# EAGLE board LSPSM (EAGLE 6.5.0)
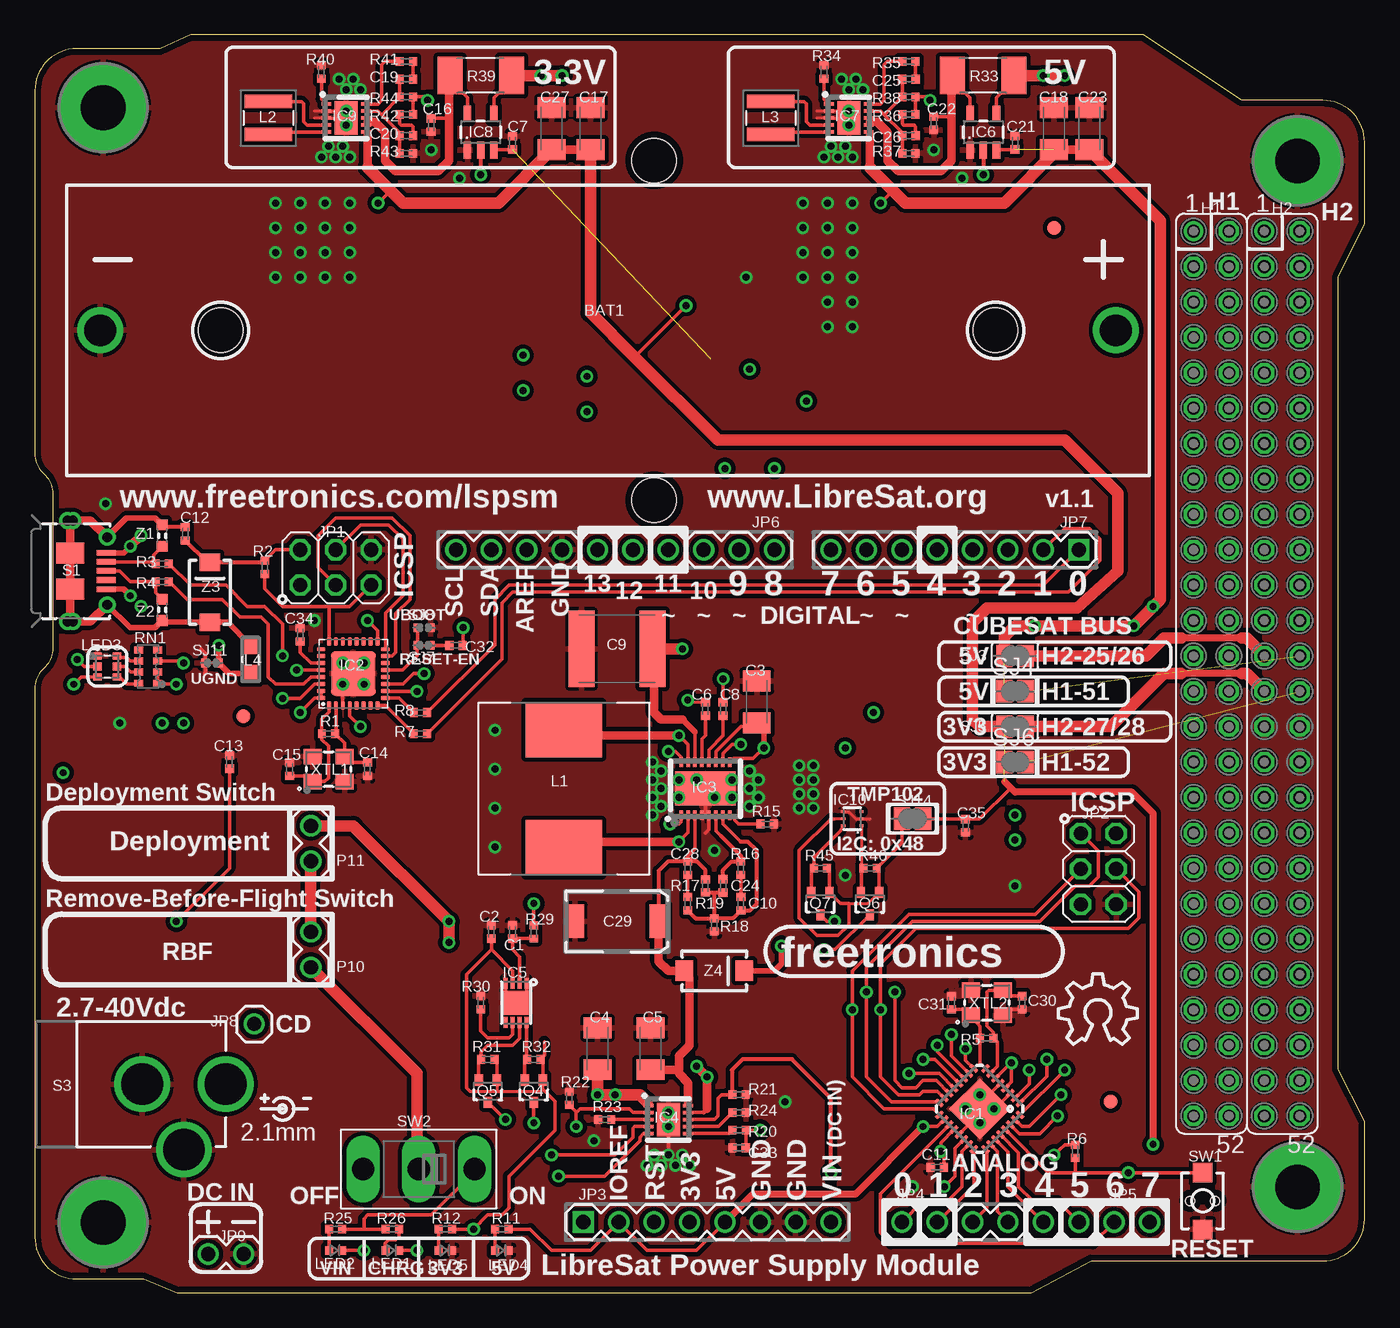
[diagram p4: board, top side]
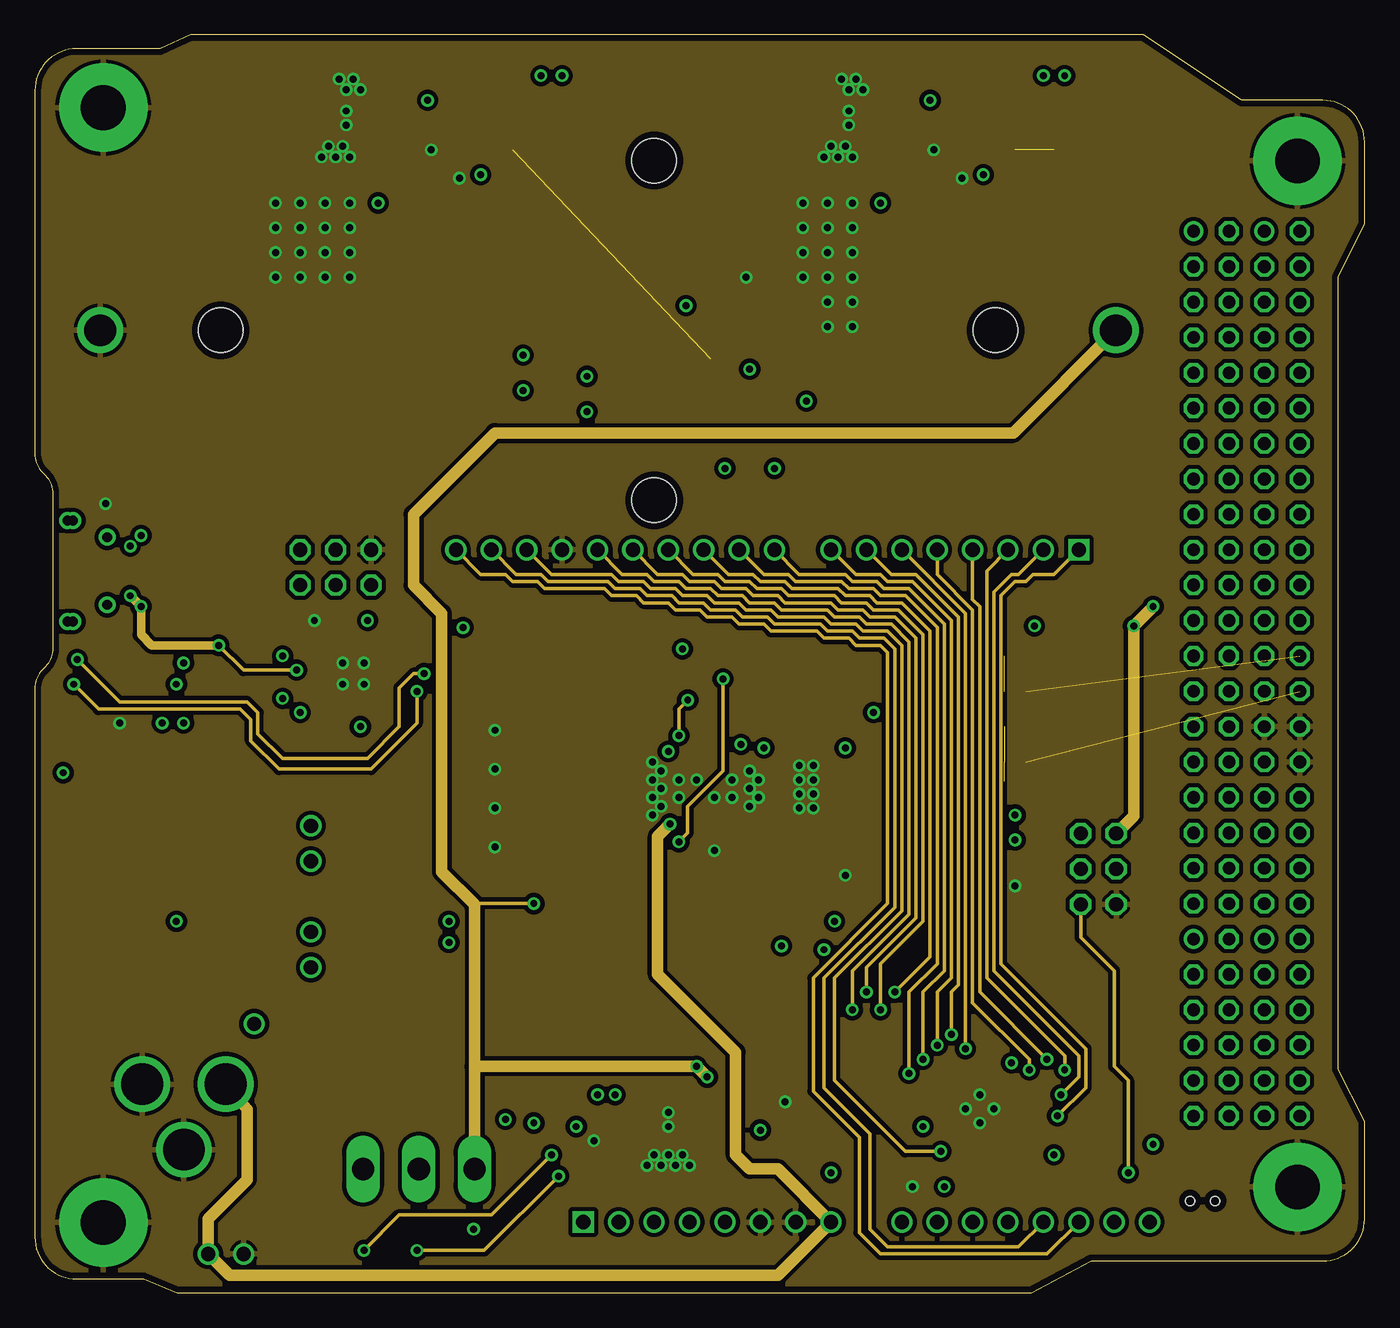
[diagram p5: board, inner layer Route2]
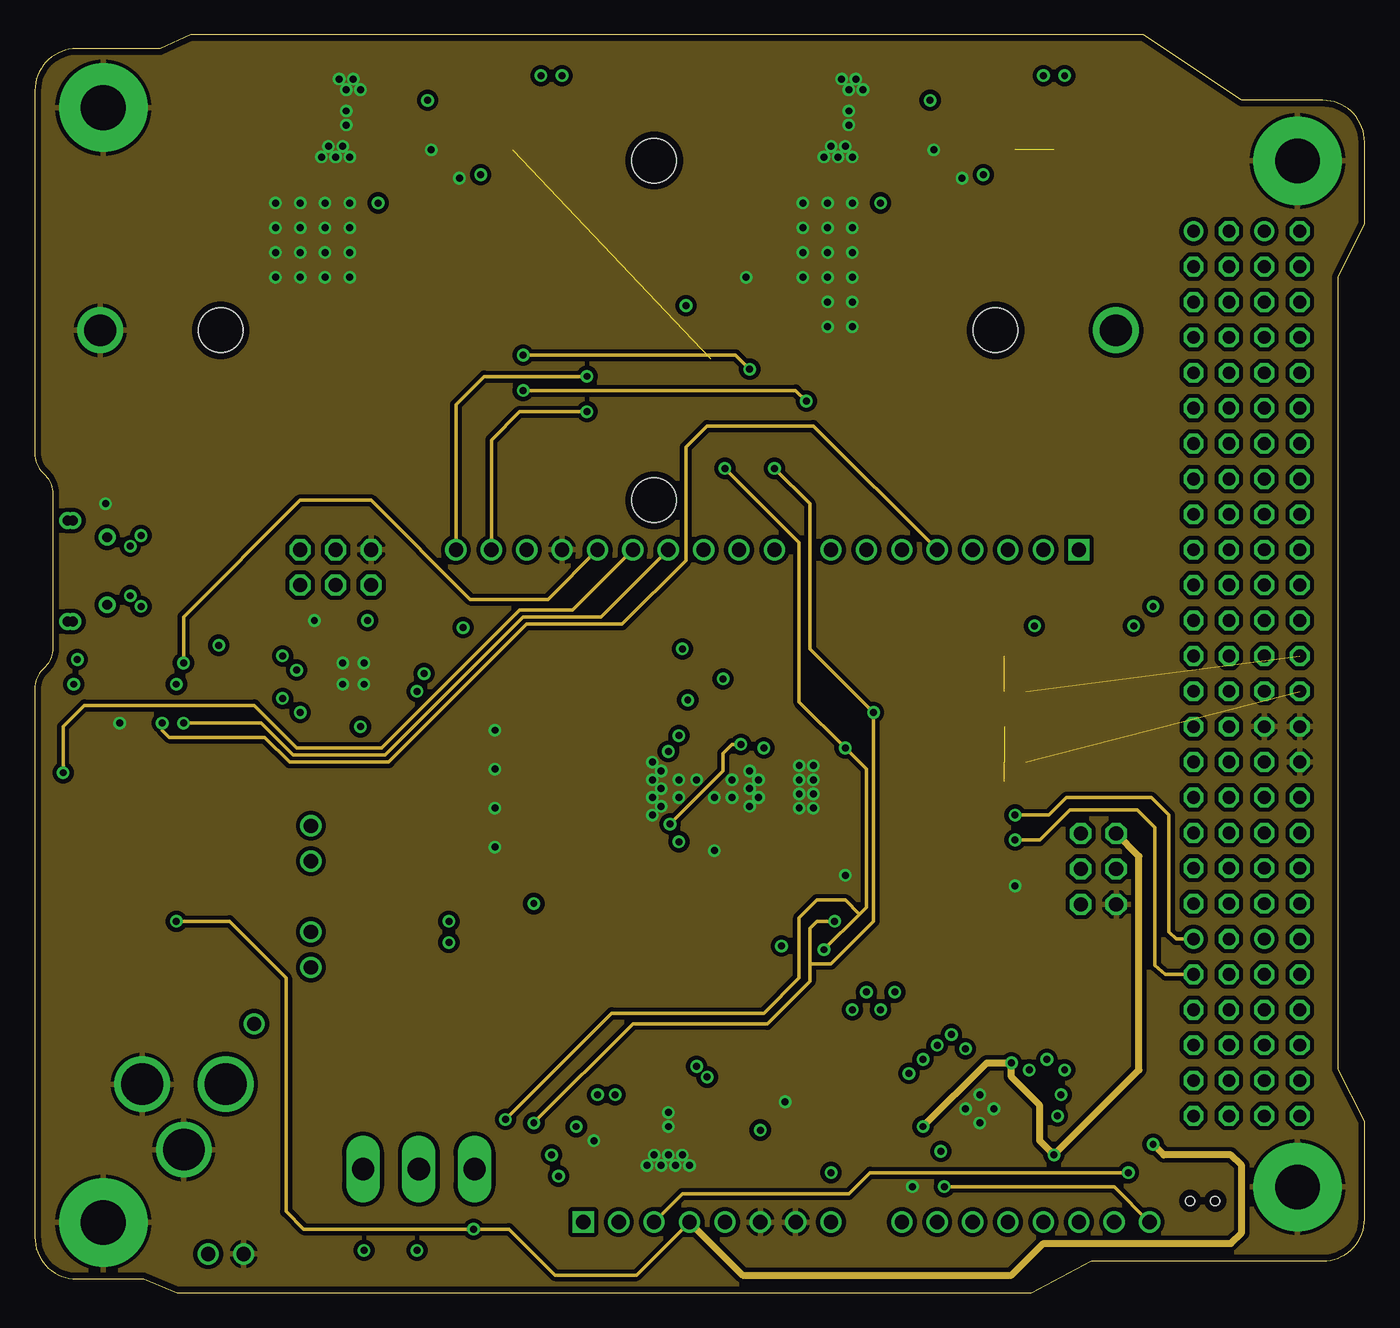
[diagram p6: board, inner layer Route15]
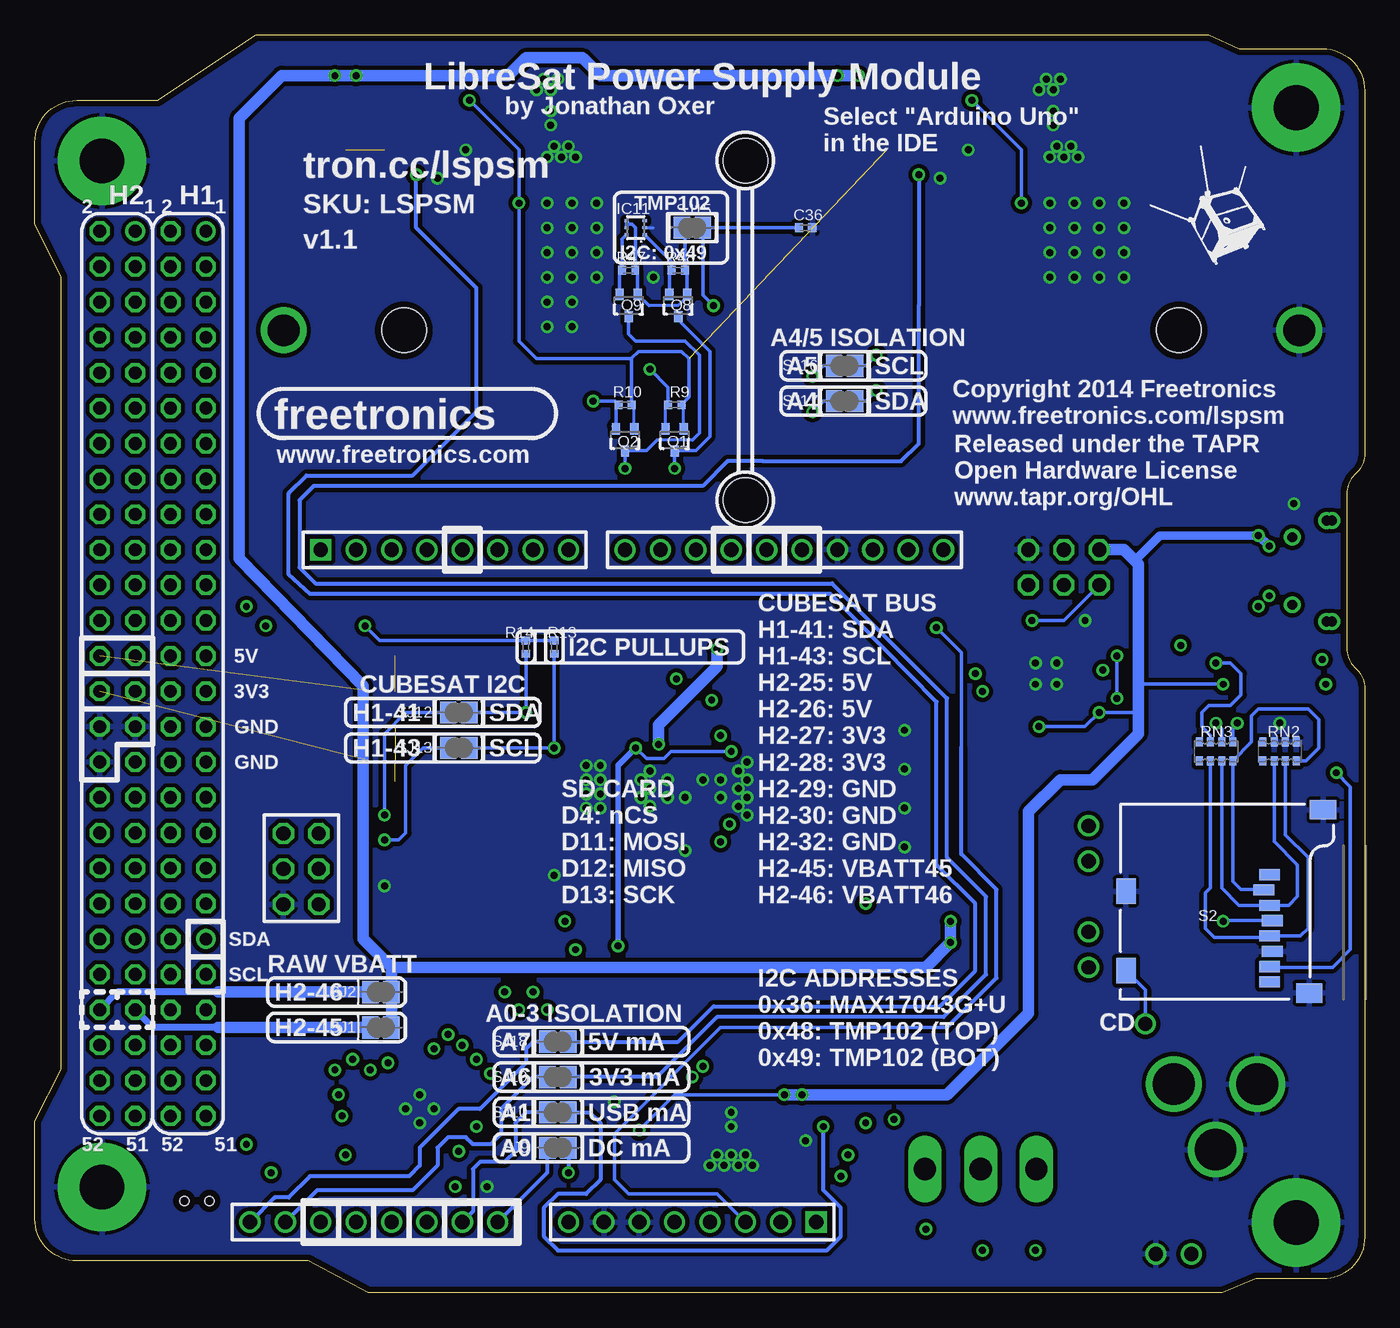
[diagram p7: board, bottom side, seen from below]

Size 95.45 x 90.3 mm. Coordinates in mm from the lower left corner, seen from the top.
Outline: 0,4 arc90 3,1 7.81,1 10.23,0 71.54,0 75.83,2.3 92.45,2.3 arc90 95.45,5.3 95.45,12.31 93.55,16.05 93.55,72.91 95.45,76.74 95.45,82.6 arc90 92.45,85.6 86.64,85.6 79.56,90.3 11.2,90.3 9,89.3 3,89.3 arc90 0,86.3 0,60.07 arc45 0.64,58.8 arc-45 1.27,57.53 1.27,46.1 arc-45 0.64,44.83 arc45 0,43.56 0,4
Copper layers (1+2*15+16): Top 0.035mm / dielectric 1.5mm / Route2 0.035mm / dielectric 0.15mm / Route15 0.035mm / dielectric 0.2mm / Bottom 0.035mm
Design rules "default *": minimum track width 6mil, minimum drill 19mil, track to track 6mil, track to pad 12mil, pad to pad 12mil, via to via 12mil, smd to smd 8mil, copper to edge 18mil, drill to drill 8mil, minimum pad ring 10mil, minimum via ring 8mil, stop-mask expansion 4mil, vias tented up to drill 20mil, thermal gap 10mil
Net classes: 0 default: width 0.152 mm, drill 0.241 mm, clearance 0.152 mm
Holes 3.2 mm at 44.45,81.28 44.45,56.9

## Footprints (pad centres in the part's own frame; a part is rotated, then mirrored left to right if it is on the bottom)
BH-18650-PC = drill 2.286: + 36.449,0; - -36.449,0 | hole 3.2: -27.813,0; 27.813,0
0402C = smd 0.59 x 0.64: 1 -0.48,0; 2 0.48,0
C1206K = smd 1.5 x 2: 1 -1.5,0; 2 1.5,0
C2220K = smd 1.85 x 5.5: 1 -2.55,0; 2 2.55,0
D3L = smd 1.3 x 2.4: NEG -3,0; POS 3,0
FIDUCIAL-1X2.5 = smd 1 x 1: 1 0,0
CUBESATBUS = drill 0.914: 1 -31.75,-1.27; 41 19.05,-1.27 | drill 0.914 octagon: 2 -31.75,1.27; 3 -29.21,-1.27; 4 -29.21,1.27; 5 -26.67,-1.27; 6 -26.67,1.27; 7 -24.13,-1.27; 8 -24.13,1.27; 9 -21.59,-1.27; 10 -21.59,1.27; 11 -19.05,-1.27; 12 -19.05,1.27; 13 -16.51,-1.27; 14 -16.51,1.27; 15 -13.97,-1.27; 16 -13.97,1.27; 17 -11.43,-1.27; 18 -11.43,1.27; 19 -8.89,-1.27; 20 -8.89,1.27; 21 -6.35,-1.27; 22 -6.35,1.27; 23 -3.81,-1.27; 24 -3.81,1.27; 25 -1.27,-1.27; 26 -1.27,1.27; 27 1.27,-1.27; 28 1.27,1.27; 29 3.81,-1.27; 30 3.81,1.27; 31 6.35,-1.27; 32 6.35,1.27; 33 8.89,-1.27; 34 8.89,1.27; 35 11.43,-1.27; 36 11.43,1.27; 37 13.97,-1.27; 38 13.97,1.27; 39 16.51,-1.27; 40 16.51,1.27; 42 19.05,1.27; 43 21.59,-1.27; 44 21.59,1.27; 45 24.13,-1.27; 46 24.13,1.27; 47 26.67,-1.27; 48 26.67,1.27; 49 29.21,-1.27; 50 29.21,1.27; 51 31.75,-1.27; 52 31.75,1.27
MLF32 = smd 0.7 x 0.3: 1 -2.35,1.75; 2 -2.35,1.25; 3 -2.35,0.75; 4 -2.35,0.25; 5 -2.35,-0.25; 6 -2.35,-0.75; 7 -2.35,-1.25; 8 -2.35,-1.75; 17 2.35,-1.75; 18 2.35,-1.25; 19 2.35,-0.75; 20 2.35,-0.25; 21 2.35,0.25; 22 2.35,0.75; 23 2.35,1.25; 24 2.35,1.75 | smd 0.3 x 0.7: 9 -1.75,-2.35; 10 -1.25,-2.35; 11 -0.75,-2.35; 12 -0.25,-2.35; 13 0.25,-2.35; 14 0.75,-2.35; 15 1.25,-2.35; 16 1.75,-2.35; 25 1.75,2.35; 26 1.25,2.35; 27 0.75,2.35; 28 0.25,2.35; 29 -0.25,2.35; 30 -0.75,2.35; 31 -1.25,2.35; 32 -1.75,2.35 | smd 3.1 x 3.1: TGND 0,0
ATMEL_QFN32 = smd 0.6 x 0.3: 1 -2.3,1.75; 2 -2.3,1.25; 3 -2.3,0.75; 4 -2.3,0.25; 5 -2.3,-0.25; 6 -2.3,-0.75; 7 -2.3,-1.25; 8 -2.3,-1.75; 17 2.3,-1.75; 18 2.3,-1.25; 19 2.3,-0.75; 20 2.3,-0.25; 21 2.3,0.25; 22 2.3,0.75; 23 2.3,1.25; 24 2.3,1.75 | smd 0.3 x 0.6: 9 -1.75,-2.3; 10 -1.25,-2.3; 11 -0.75,-2.3; 12 -0.25,-2.3; 13 0.25,-2.3; 14 0.75,-2.3; 15 1.25,-2.3; 16 1.75,-2.3; 25 1.75,2.3; 26 1.25,2.3; 27 0.75,2.3; 28 0.25,2.3; 29 -0.25,2.3; 30 -0.75,2.3; 31 -1.25,2.3; 32 -1.75,2.3 | smd 3.2 x 3.2: EXP 0,0
DFN-16 = smd 0.25 x 0.7: 1 -1.75,-1.9; 2 -1.25,-1.9; 3 -0.75,-1.9; 4 -0.25,-1.9; 5 0.25,-1.9; 6 0.75,-1.9; 7 1.25,-1.9; 8 1.75,-1.9; 9 1.75,1.9; 10 1.25,1.9; 11 0.75,1.9; 12 0.25,1.9; 13 -0.25,1.9; 14 -0.75,1.9; 15 -1.25,1.9; 16 -1.75,1.9 | smd 4.34 x 2.44: TGND 0,0
DFN-10 = smd 0.25 x 0.7: 1 -1,-1.425; 2 -0.5,-1.425; 3 0,-1.425; 4 0.5,-1.425; 5 1,-1.425; 6 1,1.425; 7 0.5,1.425; 8 0,1.425; 9 -0.5,1.425; 10 -1,1.425 | smd 2.38 x 1.65: TGND 0,0
TDFN-8 = smd 0.8 x 0.3: 1 -1.4,0.75; 2 -1.4,0.25; 3 -1.4,-0.25; 4 -1.4,-0.75; 5 1.4,-0.75; 6 1.4,-0.25; 7 1.4,0.25; 8 1.4,0.75 | smd 1.73 x 1.88: EP 0,0
SOT23-5 = smd 0.55 x 1.2: 1 -0.95,-1.3; 2 0,-1.3; 3 0.95,-1.3; 4 0.95,1.3; 5 -0.95,1.3
SOT563 = smd 0.2 x 0.3: 1 -0.5,-0.65; 2 0,-0.65; 3 0.5,-0.65; 4 0.5,0.65; 5 0,0.65; 6 -0.5,0.65
2X03 = drill 1.016 octagon: 1 -2.54,-1.27; 2 -2.54,1.27; 3 0,-1.27; 4 0,1.27; 5 2.54,-1.27; 6 2.54,1.27
1X08 = drill 1.016 square: 1 0,0 | drill 1.016: 2 2.54,0; 3 5.08,0; 4 7.62,0; 5 10.16,0; 6 12.7,0; 7 15.24,0; 8 17.78,0
1X06 = drill 1.016: 1 0,0; 2 2.54,0; 3 5.08,0; 4 7.62,0; 5 10.16,0; 6 12.7,0
1X02 = drill 1.016: 1 0,0; 2 2.54,0
1X10 = drill 1.016: 1 0,0; 2 2.54,0; 3 5.08,0; 4 7.62,0; 5 10.16,0; 6 12.7,0; 7 15.24,0; 8 17.78,0; 9 20.32,0; 10 22.86,0
1X01 = drill 1.016: 1 0,0
MSS1260 = smd 5.512 x 3.988: 1 0,4.242; 2 0,-4.242
XFL4020 = smd 3.404 x 0.965: 1 0,1.181; 2 0,-1.181
0805-LARGE = smd 1.27 x 1.27: 1 -1.016,0; 2 1.016,0
LED-0402 = smd 0.571 x 0.62: A -0.48,0; C 0.48,0
19-337 = smd 0.6 x 0.5: 1 -0.7,0.75; 3 -0.7,-0.75; 4 0.7,0.75; 6 0.7,-0.75 | smd 0.6 x 0.6: 2 -0.7,0; 5 0.7,0
HOLE32 = drill 3.2 pad 6.35: P$1 0,0
SOT32-3 = smd 0.6 x 0.8: 1 -0.65,-0.8; 2 0.65,-0.8; 3 0,0.8
0402 = smd 0.571 x 0.62: 1 -0.48,0; 2 0.48,0
R2010 = smd 1.8 x 2.7: 1 -2.2,0; 2 2.2,0
CAY16 = smd 0.5 x 0.65: 1 -1.2,-0.675; 2 -0.4,-0.675; 3 0.4,-0.675; 4 1.2,-0.675; 5 1.2,0.675; 6 0.4,0.675; 7 -0.4,0.675; 8 -1.2,0.675
USB-MICROB-MB05PMXX = smd 0.4 x 1.35: D+ 0,2.575; D- -0.65,2.575; GND 1.3,2.575; ID 0.65,2.575; VBUS -1.3,2.575 | smd 1.5 x 2: FIX1 -1.3,0; FIX2 1.3,0 | drill 0.7: PIN1 -2.425,2.65; PIN2 2.425,2.65; SLOT1 -3.625,-0.2; SLOT2 3.625,-0.2; TAB1 -3.625,0.2; TAB2 3.625,0.2
MICRO-SD-SOCKET-PP = smd 0.8 x 1.5: 1 -8.94,10.7; 2 -7.84,10.3; 3 -6.74,10.7; 4 -5.64,10.9; 5 -4.54,10.7; 6 -3.44,10.9; 7 -2.34,10.7; 8 -1.24,10.7 | smd 1.8 x 1.4: CD1 -2.05,0.4; CD2 -7.75,0.4 | smd 1.4 x 1.9: GND1 -0.45,13.55; GND2 -13.6,14.55
POWER_JACK_PTH = drill 2.997: GND 0,7.7; GNDBREAK 4.7,10.7; PWR 0,13.7
SJ = smd 1.168 x 1.6: 1 -0.762,0; 2 0.762,0
SJC = smd 1.168 x 1.6: 1 -0.762,0; 2 0.762,0
0402SJC = smd 0.571 x 0.62: 1 -0.48,0; 2 0.48,0
0402SJO = smd 0.571 x 0.62: 1 -0.48,0; 2 0.48,0
TACTILE_SWITCH_SMD_2PIN_TINY = smd 1.4 x 1.4: 1 -2.05,0; 2 2.05,0 | hole 0.65: 0,0.9; 0,-0.9
SS-12F100 = drill 1.6 long: 1 -4,0; 2 0,0; 3 4,0
CRYSTAL-SMD-3X2 = smd 1.3 x 1.1: 1 -1.15,-0.9; 2 1.15,-0.9; 3 1.15,0.9; 4 -1.15,0.9
0603 = smd 0.762 x 0.762: 1 -0.762,0; 2 0.762,0
SMA-DIODE = smd 1.27 x 1.47: A -2.15,0; C 2.15,0

## Placement (x,y rotation side)
BAT1  CELLHOLDER-PCB  [BH-18650-PC]  41.15,69.09 0 top
C1  1uF  [0402C]  34.29,25.91 90 top
C2  10nF 0402  [0402C]  32.77,25.91 90 top
C3  4.7uF TANTALUM  [C1206K]  51.82,42.42 270 top
C4  1uF TANTALUM  [C1206K]  40.39,17.53 270 top
C5  1uF TANTALUM  [C1206K]  44.2,17.53 270 top
C6  100nF 0402  [0402C]  48.13,41.91 270 top
C7  100nF 0402  [0402C]  34.29,82.55 90 top
C8  100nF 0402  [0402C]  49.4,41.91 270 top
C9  10uF Murata GRM55DR61H106K 2220  [C2220K]  41.78,46.23 0 top
C10  3300pF 0402  [0402C]  50.67,27.94 270 top
C11  100nF 0402  [0402C]  64.77,9.02 180 top
C12  1uF 0402  [0402C]  10.79,54.48 90 top
C13  100nF 0402  [0402C]  13.97,38.1 90 top
C14  15pF 0402  [0402C]  23.88,37.59 90 top
C15  15pF 0402  [0402C]  18.29,37.59 270 top
C16  10nF  [0402C]  28.45,83.82 270 top
C17  100uF  [C1206K]  39.88,83.57 270 top
C18  47uF  [C1206K]  73.15,83.57 270 top
C19  1nF 0402  [0402C]  26.67,87.12 180 top
C20  100pF  [0402C]  26.67,83.06 0 top
C21  100nF 0402  [0402C]  70.36,82.55 90 top
C22  10nF  [0402C]  64.52,83.95 270 top
C23  100uF  [C1206K]  75.69,83.57 270 top
C24  27pF 0402  [0402C]  49.4,29.21 270 top
C25  1nF  [0402C]  62.74,87.12 180 top
C26  100pF 0402  [0402C]  62.74,83.06 0 top
C27  47uF  [C1206K]  37.08,83.57 270 top
C28  82pF 0402  [0402C]  46.86,30.48 270 top
C29  330uF 6.3V Sanyo TPB D3L  [D3L]  41.78,26.67 0 top
C30  22pF 0402  [0402C]  70.87,20.83 90 top
C31  22pF 0402  [0402C]  65.79,20.83 270 top
C32  100nF 0402  [0402C]  30.23,46.48 0 top
C33  100nF 0402  [0402C]  50.55,10.41 180 top
C34  1uF 0402  [0402C]  19.05,47.24 90 top
C35  100nF 0402  [0402C]  66.8,33.53 270 top
C36  100nF 0402  [0402C]  40.13,76.45 0 bottom
FID1  FIDUCIAL1X2.5  [FIDUCIAL-1X2.5]  14.99,41.4 0 top
FID2  FIDUCIAL1X2.5  [FIDUCIAL-1X2.5]  77.22,13.72 0 top
FID3  FIDUCIAL1X2.5  [FIDUCIAL-1X2.5]  73.15,76.45 0 top
H1  CUBESATBUSH  [CUBESATBUS]  84.44,44.45 270 top
H2  CUBESATBUSH  [CUBESATBUS]  89.52,44.45 270 top
IC1  ATmega328P  [MLF32]  67.82,13.21 225 top
IC2  ATMEGA16U2-MU  [ATMEL_QFN32]  22.86,44.45 90 top
IC3  LTC3115  [DFN-16]  48.13,36.2 0 top
IC4  LTC4078  [DFN-10]  45.47,12.45 270 top
IC5  MAX17043G+U  [TDFN-8]  34.54,20.83 270 top
IC6  MAX4372F  [SOT23-5]  68.07,83.31 0 top
IC7  LTC3536  [DFN-10]  58.42,84.33 270 top
IC8  MAX4372F  [SOT23-5]  32,83.31 0 top
IC9  LTC3536  [DFN-10]  22.35,84.33 270 top
IC10  TMP102  [SOT563]  58.67,34.04 90 top
IC11  TMP102  [SOT563]  52.32,76.45 90 bottom
JP1  ICSP:16U2  [2X03]  21.59,52.07 0 top
JP2  ICSP:328P  [2X03]  76.34,30.43 270 top
JP3  [1X08]  39.37,5.08 0 top
JP4  [1X06]  62.23,5.08 0 top
JP5  [1X02]  77.47,5.08 0 top
JP6  M100.1  [1X10]  53.09,53.34 180 top
JP7  [1X08]  74.93,53.34 180 top
JP8  CD  [1X01]  15.75,19.3 0 top
JP9  [1X02]  14.99,2.79 180 top
JP10  [1X02]  19.81,23.37 90 top
JP11  [1X02]  19.81,30.99 90 top
L1  33uH Coilcraft MSS1260-333ML  [MSS1260]  37.97,36.2 0 top
L2  4.7uH Coilcraft XFL4020  [XFL4020]  16.76,84.33 0 top
L3  4.7uH Coilcraft XFL4020  [XFL4020]  52.83,84.33 0 top
L4  0805 INDUCTOR  [0805-LARGE]  15.49,45.47 90 top
LED1  RED 0402  [LED-0402]  25.65,3.05 0 top
LED2  BLUE 0402  [LED-0402]  21.59,3.05 0 top
LED3  RGBLEDSMT  [19-337]  5.21,44.96 0 top
LED4  BLUE 0402  [LED-0402]  33.53,3.05 0 top
LED5  JADEGREEN 0402  [LED-0402]  29.46,3.05 0 top
MNT1  HOLE3.2MM  [HOLE32]  4.91,85.07 0 top
MNT2  HOLE3.2MM  [HOLE32]  90.63,81.26 0 top
MNT3  HOLE3.2MM  [HOLE32]  90.63,7.6 0 top
MNT4  HOLE3.2MM  [HOLE32]  4.91,5.05 0 top
Q1  RJU003N03 N-MOSFET  [SOT32-3]  49.53,61.21 180 bottom
Q2  RJU003N03 N-MOSFET  [SOT32-3]  53.09,61.21 180 bottom
Q4  RJU003N03 N-MOSFET  [SOT32-3]  35.81,14.48 180 top
Q5  RJU003N03 N-MOSFET  [SOT32-3]  32.51,14.48 180 top
Q6  RJU003N03 N-MOSFET  [SOT32-3]  59.94,27.94 180 top
Q7  RJU003N03 N-MOSFET  [SOT32-3]  56.39,27.94 180 top
Q8  RJU003N03 N-MOSFET  [SOT32-3]  49.28,70.87 180 bottom
Q9  RJU003N03 N-MOSFET  [SOT32-3]  52.83,70.87 180 bottom
R1  1M 0402  [0402]  21.08,40.13 0 top
R2  10K 0402  [0402]  16.51,52.07 90 top
R3  22R  [0402]  9.14,52.32 0 top
R4  22R  [0402]  9.14,51.05 0 top
R5  1M 0402  [0402]  68.33,18.29 0 top
R6  10K 0402  [0402]  74.68,10.16 90 top
R7  1K 0402  [0402]  27.69,40.13 180 top
R8  1K 0402  [0402]  27.69,41.66 180 top
R9  10K 0402  [0402]  49.53,63.75 0 bottom
R10  10K 0402  [0402]  53.09,63.75 0 bottom
R11  3K3 0402  [0402]  33.53,4.57 180 top
R12  1K5 0402  [0402]  29.46,4.57 180 top
R13  4K7 0402  [0402]  58.17,46.35 90 bottom
R14  4K7 0402  [0402]  60.2,46.35 90 bottom
R15  121K 1% 0402  [0402]  52.58,33.66 180 top
R16  93.1K 1% 0402  [0402]  50.67,30.48 270 top
R17  1M 1% 0402  [0402]  48.13,29.21 90 top
R18  249K 1% 0402  [0402]  48.77,26.42 90 top
R19  249K 1% 0402  [0402]  46.86,27.94 90 top
R20  1K  [0402]  50.55,11.68 180 top
R21  1K 1% 0402  [0402]  50.55,14.22 0 top
R22  1K 1% 0402  [0402]  38.35,13.97 90 top
R23  1K 1% 0402  [0402]  40.89,12.45 180 top
R24  10K 0402  [0402]  50.55,12.95 0 top
R25  3K3 0402  [0402]  21.59,4.57 180 top
R26  1K5 0402  [0402]  25.65,4.57 0 top
R29  1K 0402  [0402]  35.81,25.91 90 top
R30  4K7 0402  [0402]  32,20.83 270 top
R31  10K 0402  [0402]  32.51,16.76 0 top
R32  10K 0402  [0402]  35.81,16.76 0 top
R33  0.1R 2010  [R2010]  68.07,87.38 180 top
R34  100K  [0402]  56.64,87.63 90 top
R35  49.9K  [0402]  62.74,88.39 0 top
R36  15K 0402  [0402]  62.74,84.58 0 top
R37  115K 1% 0402  [0402]  62.74,81.79 0 top
R38  845K 1% 0402  [0402]  62.74,85.85 0 top
R39  0.1R 2010  [R2010]  32,87.38 180 top
R40  100K  [0402]  20.57,87.63 90 top
R41  49.9K 1% 0402  [0402]  26.67,88.39 0 top
R42  15K  [0402]  26.67,84.58 0 top
R43  187K 1% 0402  [0402]  26.67,81.79 0 top
R44  845K 1% 0402  [0402]  26.67,85.85 0 top
R45  10K 0402  [0402]  56.39,30.48 0 top
R46  10K 0402  [0402]  59.94,30.48 0 top
R47  10K 0402  [0402]  52.83,73.41 0 bottom
R48  10K 0402  [0402]  49.28,73.41 0 bottom
RN1  1K5  [CAY16]  8.13,44.96 90 top
RN2  2K2  [CAY16]  6.1,38.86 180 bottom
RN3  1K  [CAY16]  10.67,38.86 0 bottom
S1  USB-6PSMT  [USB-MICROB-MB05PMXX]  2.54,51.82 270 top
S2  microSD  [MICRO-SD-SOCKET-PP]  17.53,21.08 270 bottom
S3  POWER_JACKPTH  [POWER_JACK_PTH]  0,14.99 270 top
SJ1  VBATT45  [SJ]  70.61,19.05 180 bottom
SJ2  VBATT46  [SJ]  70.61,21.59 180 bottom
SJ3  5V_EN  [SJC]  70.36,45.72 0 top
SJ4  SJCN  [SJC]  70.36,43.18 0 top
SJ5  3V3_EN  [SJC]  70.36,40.64 0 top
SJ6  SJCN  [SJC]  70.36,38.1 0 top
SJ7  RESET-EN  [0402SJC]  27.94,46.48 0 top
SJ8  UBOOT  [0402SJO]  27.94,47.75 180 top
SJ9  DC_I  [SJC]  57.91,10.41 180 bottom
SJ10  USB_I  [SJC]  57.91,12.95 180 bottom
SJ11  UGND  [0402SJC]  12.7,45.21 180 top
SJ12  SJCN  [SJC]  65.02,41.66 180 bottom
SJ13  SJCN  [SJC]  65.02,39.12 180 bottom
SJ14  SJCN  [SJC]  62.99,34.04 180 top
SJ15  SJCN  [SJC]  48.26,76.45 180 bottom
SJ16  SJCN  [SJC]  37.34,66.55 0 bottom
SJ17  SJCN  [SJC]  37.34,64.01 0 bottom
SJ18  SJCN  [SJC]  57.91,18.03 180 bottom
SJ19  SJCN  [SJC]  57.91,15.49 180 bottom
SW1  RESET  [TACTILE_SWITCH_SMD_2PIN_TINY]  83.82,6.6 90 top
SW2  SWITCH-SPDT  [SS-12F100]  27.56,8.89 180 top
U$2  [OSHW_10X200_NOTEXT]  73.46,17.83 0 top
XTL1  16MHz  [CRYSTAL-SMD-3X2]  21.08,37.59 0 top
XTL2  16MHz  [CRYSTAL-SMD-3X2]  68.33,20.83 0 top
Z1  PGB1010603  [0603]  9.14,54.36 270 top
Z2  PGB1010603  [0603]  9.14,49.02 90 top
Z3  5.6V 1W Zener  [SMA-DIODE]  12.57,50.29 90 top
Z4  50V 1W Zener  [SMA-DIODE]  48.77,23.11 0 top

## Tracks (layer width: path | path; a pad name or v marks a point on that pad's centre or on a via)
3.3V  (via drill 0.5)  (2 unrouted)
  Top 0.203: Q5.1 33.16,14.48 | 31.24,14.48 33.16,14.48 | 33.16,14.48 36.32,14.48 36.46,14.62 Q4.1
  Top 0.254: C2.1 32.77,24.64 | 32.77,24.64 34.29,23.11 IC5.3 | 23.88,83.06 23.88,83.23 IC9.6 | Q4.1 36.46,16.59 R32.2 36.58,17.05 36.58,18.03 | Q5.1 33.16,16.59 R31.2 | 31.24,14.48 30.99,14.73 30.99,22.86 32.77,24.64 | R12.1 v31.5,4.57 32.51,5.59 33.53,5.59 34.04,6.1 34.04,8.38 37.34,11.68 37.34,13.75 36.46,14.62 | 27.18,84.58 R42.2 R44.2 27.94,85.85 v28.19,85.6 | v24.64,78.23 25.53,79.12 | C13.1 13.97,30.48 v10.16,26.67 | SJ14.1 66.52,34.04 C35.1 67.79,34.01 70.04,36.26 | v46.74,70.87 43.05,67.18
  Top 0.508: 69.6,36.7 70.04,36.26 70.36,35.94 78.74,35.94 80.26,34.42 v80.26,10.67
  Top 0.61: C17.2 C27.2 | 23.88,80.77 23.88,83.06
  Top 0.813: C27.2 37.08,82.04 33.27,78.23 26.42,78.23 25.53,79.12 23.88,80.77 | C17.2 39.88,70.36 43.05,67.18 49.02,61.21 73.91,61.21 77.72,57.4 77.72,51.82 74.8,49.15 68.33,49.15 67.31,48.13 67.31,41.15 67.82,40.64 SJ5.1
  Route15 0.254: JP3.4 43.18,1.27 37.34,1.27 34.04,4.57 v31.5,4.57 19.3,4.57 18.03,5.84 18.03,22.61 13.97,26.67 v10.16,26.67
  Route15 0.508: JP3.4 50.8,1.27 70.1,1.27 72.39,3.56 85.85,3.56 86.61,4.32 86.61,9.14 85.85,9.91 81.03,9.91 v80.26,10.67
  Bottom 0.254: v28.19,85.6 24.64,82.04 v24.64,78.23 | S2.4 10.11,26.72 v10.16,26.67 | v46.74,70.87 47.5,71.63 SJ15.1 C36.1
3V3SENSED
  Top 0.254: IC9.8 IC9.7 23.88,83.93 23.88,84.07 | IC8.5 31.05,85.79 30.23,86.61 30.23,86.95 R39.2 | C16.1 29.69,84.3 29.72,84.58
  Top 0.61: 23.88,84.07 24.38,84.07 25.15,83.31 25.15,81.28 25.91,80.52 28.96,80.52 29.72,81.28 29.72,84.58 29.72,87.29 R39.2
5V  (via drill 0.5)  (3 unrouted)
  Top 0.254: 59.94,83.06 59.84,83.16 IC7.6 | R36.2 R38.2 64.01,85.85 v64.26,85.6 | IC1.4 70.1,15.14 v70.1,16.51 70.06,16.51 IC1.6 | v63.75,11.94 64.78,11.94 IC1.18 | R6.2 73.94,10.64 v73.15,9.91 | v60.71,78.23 61.59,79.12 | R11.1 35.56,4.57 37.08,3.05 39.88,3.05 JP3.2 43.94,3.05 47.5,3.05 JP3.5 | C21.1 69.08,82.07 IC6.3 | C7.1 33.01,82.07 IC8.3
  Top 0.508: JP3.5 51.56,7.11 58.93,7.11 v63.75,11.94
  Top 0.61: C18.2 C23.2 | 59.94,80.77 59.94,83.06
  Top 0.813: C18.2 73.41,82.04 69.6,78.23 62.48,78.23 61.59,79.12 59.94,80.77 | C23.2 75.69,82.04 80.77,76.96 80.77,49.78 v80.26,49.28 v78.87,47.88 v71.75,47.88 70.36,47.88 69.6,47.12 SJ3.1
  Route2 0.813: v80.26,49.28 v78.87,47.88 78.87,34.23 JP2.2
  Route15 0.508: v63.75,11.94 68.33,16.51 v70.1,16.51 70.1,15.49 72.14,13.46 72.14,10.92 v73.15,9.91 79.25,16 79.25,31.33 JP2.2
  Bottom 0.203: Q1.1 48.88,63.58 R9.2 | Q2.1 52.44,63.58 R10.2
  Bottom 0.254: v64.26,85.6 60.71,82.04 v60.71,78.23 60.71,68.33 59.44,67.06 52.63,67.06 52.61,67.08 | 52.61,67.08 R10.2 | R9.2 48.51,64.29 48.51,67.06 49.02,67.56 52.13,67.56 52.61,67.08 | R13.2 R14.2 70.71,46.84 v71.75,47.88
5VSENSED
  Top 0.254: IC7.7 IC7.8 59.94,84.23 59.94,84.07 | IC6.5 67.12,85.79 66.55,86.36 66.29,86.36 65.79,86.87 | C22.1 65.76,84.43 65.79,84.58
  Top 0.61: 59.94,84.07 60.48,84.07 60.48,84.05 61.21,83.31 61.21,81.28 61.98,80.52 65.02,80.52 65.79,81.28 65.79,84.58 65.79,86.87 65.79,87.29 R33.2
+5V_SYS_25
  Top 0.508: 86.61,46.99 82.3,46.99
  Top 0.813: H2.25 86.98,46.99 86.61,46.99 | 82.3,46.99 81.03,46.99 79.76,45.72 SJ3.2
+5V_SYS_26  (1 unrouted)
A0
  Top 0.254: IC1.23 66.55,10.17 66.55,7.62 65.53,6.6 63.75,6.6 JP4.1
  Bottom 0.305: SJ9.2 58.67,8.64 JP4.1
A1
  Top 0.254: IC1.24 67.39,7.7 JP4.2
  Bottom 0.305: SJ10.2 60.2,12.95 60.96,12.19 60.96,10.16 61.72,9.4 63.5,9.4 64.01,8.89 64.01,5.84 JP4.2
A2
  Top 0.254: IC1.25 68.33,10.22 68.33,6.1 JP4.3
A3
  Top 0.254: IC1.26 69.09,10.17 69.09,5.84 JP4.4
A4_SDA  (via drill 0.5)
  Top 0.254: IC1.27 69.85,10.12 69.85,7.62 JP4.5
  Route2 0.254: JP6.9 34.54,51.56 36.32,51.56 36.83,51.05 41.15,51.05 41.66,50.55 43.43,50.55 43.94,50.04 45.72,50.04 46.23,49.53 48.01,49.53 48.51,49.02 50.29,49.02 50.8,48.51 52.58,48.51 53.09,48.01 56.39,48.01 56.9,47.5 58.67,47.5 59.18,46.99 60.96,46.99 61.72,46.23 61.72,27.69 56.64,22.61 56.64,14.73 59.94,11.43 59.94,4.57 61.21,3.3 70.61,3.3 JP4.5
  Route15 0.254: JP6.9 32.77,61.21 34.8,63.25 v39.62,63.25
  Bottom 0.254: v39.62,63.25 38.86,64.01 SJ17.1
A5_SCL  (via drill 0.5)
  Top 0.254: IC1.28 70.61,10.06 70.61,7.62 71.63,6.6 73.41,6.6 JP4.6
  Route2 0.254: JP6.10 32,51.56 33.78,51.56 34.29,51.05 36.07,51.05 36.58,50.55 40.89,50.55 41.4,50.04 43.18,50.04 43.69,49.53 45.47,49.53 45.97,49.02 47.75,49.02 48.26,48.51 50.04,48.51 50.55,48.01 52.32,48.01 52.83,47.5 56.13,47.5 56.64,46.99 58.42,46.99 58.93,46.48 60.71,46.48 61.21,45.97 61.21,27.94 55.88,22.61 55.88,14.48 59.18,11.18 59.18,4.32 60.71,2.79 72.64,2.79 JP4.6
  Route15 0.254: JP6.10 30.23,63.75 32.26,65.79 v39.62,65.79
  Bottom 0.254: v39.62,65.79 38.86,66.55 SJ16.1
A6
  Top 0.254: JP5.1 75.95,3.56 61.47,3.56 60.71,4.32 60.71,7.11 65.63,12.03 IC1.19
  Bottom 0.305: SJ19.2 59.69,15.49 61.98,13.21 61.98,11.43 62.74,10.67 64.01,10.67 64.52,11.18 65.79,11.18 66.55,10.41 66.55,9.14 68.33,7.37 75.18,7.37 JP5.1
A7  (via drill 0.5)
  Top 0.254: v65.28,7.62 66.04,8.38 66.04,10.37 IC1.22
  Route15 0.254: JP5.2 77.47,7.62 v65.28,7.62
  Bottom 0.305: SJ18.2 59.69,18.03 60.2,17.53 60.2,16.51 63.5,13.21 65.02,13.21 67.82,10.41 67.82,9.14 68.58,8.38 75.69,8.38 77.22,6.86 78.23,6.86 JP5.2
AREF  (via drill 0.5)
  Top 0.254: IC1.20 65.02,10.77 v65.02,10.16 65.25,9.93 C11.1
  Route2 0.254: v65.02,10.16 62.48,10.16 57.4,15.24 57.4,22.61 62.23,27.43 62.23,46.48 61.21,47.5 59.44,47.5 58.93,48.01 57.15,48.01 56.64,48.51 53.34,48.51 52.83,49.02 51.05,49.02 50.55,49.53 48.77,49.53 48.26,50.04 46.48,50.04 45.97,50.55 44.2,50.55 43.69,51.05 41.91,51.05 41.4,51.56 37.08,51.56 JP6.8
BAT  (via drill 0.5)
  Top 0.254: R29.2 v35.81,27.94 | R25.1 23.62,4.57 | R26.1 23.62,4.57 | SW2.1 31.56,8.7 28.45,5.59 23.88,5.59 23.62,5.33 23.62,4.57 | IC4.9 48,12.95
  Top 0.305: 48,12.95 48.26,13.21
  Top 0.61: 48.26,13.21 v48.26,15.49 v47.5,16.26
  Route2 0.254: v35.81,27.94 31.81,27.94 31.56,27.69
  Route2 0.813: 31.56,16.26 31.56,27.69 31.56,27.88 29.21,30.23 29.21,48.77 27.18,50.8 27.18,55.88 33.02,61.72 70.23,61.72 BAT1.+ | 31.56,16.26 SW2.1 | 31.56,16.26 v47.5,16.26 v48.26,15.49
CELL
  Top 0.254: IC5.2 34.79,24.13 34.29,24.64 C1.1 R29.1
D0_RX  (via drill 0.5)
  Top 0.254: IC1.30 70.66,11.43 72.14,11.43 v73.41,12.7 | R8.1 33.02,46.51 33.02,49.78 34.04,50.8 72.39,50.8 JP7.1
  Route2 0.254: JP7.1 73.15,51.56 71.63,51.56 71.12,51.05 70.36,51.05 69.34,50.04 69.34,23.62 75.44,17.53 75.44,14.73 v73.41,12.7
D1_TX  (via drill 0.5)
  Top 0.254: IC1.31 70.86,11.94 71.37,11.94 v73.66,14.22 | R7.1 33.53,45.49 33.53,49.53 34.29,50.29 74.17,50.29 76.45,52.58 76.45,54.1 75.69,54.86 73.91,54.86 JP7.2
  Route2 0.254: v73.66,14.22 74.93,15.49 74.93,17.02 68.83,23.11 68.83,50.29 70.1,51.56 70.61,51.56 JP7.2
D2  (via drill 0.5)
  Top 0.254: IC1.32 73.91,15.98 v73.91,16
  Route2 0.254: JP7.3 68.33,51.82 68.33,22.61 73.91,17.02 v73.91,16
D3  (via drill 0.5)
  Top 0.254: IC1.1 72.64,15.56 v72.64,16.76
  Route2 0.254: JP7.4 67.31,49.78 67.82,49.28 67.82,21.59 v72.64,16.76
D4  (via drill 0.5)
  Top 0.254: IC1.2 71.37,15 v71.37,16
  Route2 0.254: JP7.5 64.77,51.56 67.31,49.02 67.31,20.83 71.37,16.76 v71.37,16
  Route15 0.254: v9.14,40.89 9.14,40.39 9.65,39.88 16.51,39.88 18.29,38.1 25.4,38.1 35.31,48.01 42.16,48.01 46.74,52.58 46.74,60.71 48.26,62.23 55.88,62.23 JP7.5
  Bottom 0.254: RN3.5 9.47,40.57 v9.14,40.89
D5  (via drill 0.5)
  Top 0.254: IC1.9 66.8,16.7 v66.8,17.53
  Route2 0.254: v66.8,17.53 66.8,48.77 JP7.6
D6  (via drill 0.5)
  Top 0.254: IC1.10 65.79,17.01 v65.79,18.54
  Route2 0.254: v65.79,18.54 65.79,21.59 66.29,22.1 66.29,48.51 63.25,51.56 61.47,51.56 JP7.7
D7  (via drill 0.5)
  Top 0.254: IC1.11 64.77,17.32 v64.77,17.78
  Route2 0.254: v64.77,17.78 64.77,21.59 65.79,22.61 65.79,48.26 62.99,51.05 61.21,51.05 60.71,51.56 58.93,51.56 JP7.8
D8  (via drill 0.5)
  Top 0.254: IC1.12 64.62,16.76 v63.75,16.76
  Route2 0.254: v63.75,16.76 63.75,21.59 65.28,23.11 65.28,48.01 62.74,50.55 60.96,50.55 60.45,51.05 58.67,51.05 58.17,51.56 54.86,51.56 JP6.1
D9  (via drill 0.5)
  Top 0.254: IC1.13 64.92,15.75 v62.74,15.75
  Route2 0.254: v62.74,15.75 62.74,21.59 64.77,23.62 64.77,47.75 62.48,50.04 60.71,50.04 60.2,50.55 58.42,50.55 57.91,51.05 54.61,51.05 54.1,51.56 52.32,51.56 JP6.2
D10  (via drill 0.5)
  Top 0.254: IC1.14 64.72,15.24 63.75,15.24 63.25,14.73 62.23,14.73 61.72,15.24 v61.72,21.59
  Route2 0.254: v61.72,21.59 64.26,24.13 64.26,47.5 62.23,49.53 60.45,49.53 59.94,50.04 58.17,50.04 57.66,50.55 54.36,50.55 53.85,51.05 52.07,51.05 51.56,51.56 49.78,51.56 JP6.3
D11_MOSI  (via drill 0.5)
  Top 0.254: IC1.15 64.78,14.48 63.75,14.48 63.5,14.22 61.98,14.22 60.71,15.49 v60.71,20.32 60.71,23.62 63.25,26.16 78.49,26.16 79.25,26.92 79.25,28.79 JP2.4
  Route2 0.254: v60.71,20.32 60.71,23.62 63.75,26.67 63.75,47.24 61.98,49.02 60.2,49.02 59.69,49.53 57.91,49.53 57.4,50.04 54.1,50.04 53.59,50.55 51.82,50.55 51.31,51.05 49.53,51.05 49.02,51.56 47.24,51.56 JP6.4
  Route15 0.254: v10.67,40.89 16.26,40.89 18.54,38.61 25.15,38.61 35.05,48.51 40.64,48.51 JP6.4
  Bottom 0.254: RN3.6 10.27,40.49 v10.67,40.89
D12_MISO  (via drill 0.5)
  Top 0.254: IC1.16 64.83,13.72 61.47,13.72 59.69,15.49 v59.69,21.59 59.69,23.37 62.99,26.67 72.14,26.67 74.68,29.21 75.69,29.21 76.33,29.84 76.33,31.71 JP2.1
  Route2 0.254: v59.69,21.59 59.69,23.37 63.25,26.92 63.25,46.99 61.72,48.51 59.94,48.51 59.44,49.02 57.66,49.02 57.15,49.53 53.85,49.53 53.34,50.04 51.56,50.04 51.05,50.55 49.28,50.55 48.77,51.05 46.99,51.05 46.48,51.56 44.7,51.56 JP6.5
  Route15 0.254: v2.03,37.34 2.03,40.64 3.56,42.16 15.75,42.16 18.8,39.12 24.89,39.12 34.8,49.02 38.61,49.02 JP6.5
  Bottom 0.254: S2.7 6.88,23.37 2.29,23.37 1.02,24.64 1.02,36.32 v2.03,37.34
D13_SCK  (via drill 0.5)
  Top 0.254: IC1.17 64.5,13.21 60.96,13.21 58.67,15.49 v58.67,20.32 58.67,23.11 62.74,27.18 71.82,27.18 JP2.3 | RN1.3 10.52,45.36 v10.67,45.21
  Route2 0.254: v58.67,20.32 58.67,23.11 62.74,27.18 62.74,46.74 61.47,48.01 59.69,48.01 59.18,48.51 57.4,48.51 56.9,49.02 53.59,49.02 53.09,49.53 51.31,49.53 50.8,50.04 49.02,50.04 48.51,50.55 46.74,50.55 46.23,51.05 44.45,51.05 43.94,51.56 42.16,51.56 JP6.6
  Route15 0.254: v10.67,45.21 10.67,48.51 19.05,56.9 24.13,56.9 31.24,49.78 36.83,49.78 JP6.6
  Bottom 0.254: v10.67,45.21 9.65,45.21 8.89,44.45 8.89,42.93 9.65,42.16 11.18,42.16 11.68,41.66 11.68,40.64 11.07,40.02 RN3.7
D+
  Top 0.254: Z2.2 8.66,50.26 R4.1 6.86,51.05 6.1,51.82 S1.D+
D-
  Top 0.254: 8.52,52.47 8.52,52.97 Z1.2 | S1.D- 8.52,52.47 | 8.52,52.47 R3.1
DC_I  (via drill 0.5)
  Top 0.254: IC4.8 48.77,12.45 49.02,12.7 49.02,13.97 49.28,14.22 R21.1
  Top 0.305: v57.15,8.64 57.15,13.97 54.36,16.76 50.8,16.76 50.04,16 50.04,14.25 R21.1
  Bottom 0.305: SJ9.1 v57.15,8.64
DTR
  Top 0.254: IC2.13 26.41,44.7 27.43,45.72 27.43,46.45 SJ7.1 SJ8.2
GND  (via drill 0.5)
  Top 0.203: IC7.TGND IC7.3 56.13,84.33 | IC9.TGND IC9.3 20.07,84.33 | 59.94,34.04 IC10.2 58.93,34.04 58.43,34.54 IC10.4 | 56.13,84.84 57.91,84.84 | 20.07,84.84 22.1,84.84
  Top 0.254: 35.29,21.35 IC5.1 35.29,21.58 IC5.EP 33.79,21.58 IC5.4 | 48.13,33.02 48.38,33.27 IC3.5 IC3.4 48.13,34.29 48.13,34.92 v48.77,35.56 | IC7.2 IC7.3 | IC9.2 IC9.3 | IC4.TGND v45.47,9.91 | IC1.21 67.82,12.85 IC1.TGND | IC1.3 68.88,13.21 v68.83,13.21 IC1.TGND | IC1.5 67.82,13.56 IC1.TGND | C30.1 69.9,20.35 XTL2.2 | IC2.3 v22.11,43.7 | v22.11,43.7 IC2.EXP 22.61,44.7 | SJ11.2 12.22,45.95 11.94,46.23 | v22.1,43.69 v22.11,43.7
  Top 0.305: SJ11.2 12.22,44.48 12.19,44.45
  Bottom 0.203: IC11.2 51.05,76.45
  other vias: 46.23,36.83 46.23,35.56 47.5,36.83 50.04,35.56 50.04,36.83 44.96,36.2 44.96,37.47 44.96,34.92 44.32,34.29 44.32,35.56 44.32,36.83 44.32,38.1 48.77,31.75 51.31,36.2 51.94,35.56 51.94,36.83 51.31,37.47 51.31,34.92 56.64,81.53 57.15,82.3 57.66,81.53 58.17,82.3 58.67,81.53 59.44,86.36 58.42,86.36 57.91,87.12 58.93,87.12 22.35,86.36 22.1,82.3 22.61,81.53 21.59,81.53 21.08,82.3 20.57,81.53 22.86,87.12 21.84,87.12 23.37,86.36 28.45,82.04 58.17,29.97 6.1,40.89 5.08,56.64 45.47,12.95 45.47,11.94 44.45,9.91 46.48,9.91 46.99,9.14 45.97,9.14 44.96,9.14 43.94,9.14 51.05,72.9 55.12,78.23 56.9,71.12 58.67,69.34 58.67,71.12 33.02,32 33.02,34.8 33.02,37.59 33.02,40.39 53.85,13.72 55.12,76.45 55.12,74.68 56.9,69.34 55.12,72.9 58.42,84.84 58.42,83.82 22.35,84.84 22.35,83.82 62.99,7.62 70.36,29.21 64.52,82.04 67.82,12.19 67.82,14.22 66.8,13.21 22.1,45.21 23.62,45.21 23.62,43.69 30.48,80.01 66.55,80.01 20.07,48.26 40.13,10.92 58.67,78.23 56.9,74.68 58.67,72.9 58.67,74.68 58.67,76.45 56.9,76.45 56.9,72.9 56.9,78.23 19.05,78.23 17.27,74.68 19.05,72.9 19.05,74.68 19.05,76.45 17.27,76.45 17.27,72.9 17.27,78.23 20.83,72.9 20.83,78.23 20.83,76.45 20.83,74.68 22.61,72.9 22.61,78.23 22.61,76.45 22.61,74.68 54.86,36.83 54.86,35.81 54.86,34.8 54.86,37.85 55.88,37.85 55.88,36.83 55.88,35.81 55.88,34.8
  pour Bottom (isolate 0.305): 0,86.3 arc-90 3,89.3 9,89.3 11.2,90.3 79.56,90.3 86.64,85.6 92.45,85.6 arc-90 95.45,82.6 95.45,76.74 93.55,72.91 93.55,16.05 95.45,12.31 95.45,5.08 arc-90 92.45,2.3 75.83,2.3 71.54,0 10.16,0 7.81,1 3,1 arc-90 0,4 0,43.56 arc-45 0.64,44.83 arc45 1.27,46.1 1.27,57.53 arc45 0.64,58.8 arc-45 0,60.07
  pour Top (isolate 0.305): 0,86.3 arc-90 3,89.3 9,89.3 11.2,90.3 79.56,90.3 86.64,85.6 92.45,85.6 arc-90 95.45,82.6 95.45,76.74 93.55,72.91 93.55,16.05 95.45,12.31 95.45,5.08 arc-90 92.45,2.3 75.83,2.3 71.54,0 10.16,0 7.81,1 3,1 arc-90 0,4 0,43.56 arc-45 0.64,44.83 arc45 1.27,46.1 1.27,57.53 arc45 0.64,58.8 arc-45 0,60.07
  pour Route2 (isolate 0.305): 0,86.3 arc-90 3,89.3 9,89.3 11.2,90.3 79.56,90.3 86.64,85.6 92.45,85.6 arc-90 95.45,82.6 95.45,76.74 93.55,72.91 93.55,16.05 95.45,12.31 95.45,5.08 arc-90 92.45,2.3 75.83,2.3 71.54,0 10.16,0 7.81,1 3,1 arc-90 0,4 0,43.56 arc-45 0.64,44.83 arc45 1.27,46.1 1.27,57.53 arc45 0.64,58.8 arc-45 0,60.07
  pour Route15 (isolate 0.305): 0,86.3 arc-90 3,89.3 9,89.3 11.2,90.3 79.56,90.3 86.64,85.6 92.45,85.6 arc-90 95.45,82.6 95.45,76.74 93.55,72.91 93.55,16.05 95.45,12.31 95.45,5.08 arc-90 92.45,2.3 75.83,2.3 71.54,0 10.16,0 7.81,1 3,1 arc-90 0,4 0,43.56 arc-45 0.64,44.83 arc45 1.27,46.1 1.27,57.53 arc45 0.64,58.8 arc-45 0,60.07
MISO2  (via drill 0.5)
  Top 0.254: IC2.17 24.61,47.53 v23.88,48.26
  Bottom 0.254: v23.88,48.26 21.59,48.26 JP1.1
MOSI2
  Top 0.254: IC2.16 25.16,48.78 26.42,50.04 26.42,54.1 25.4,55.12 23.37,55.12 JP1.4
N$1
  Top 0.254: R12.2 LED5.A
N$2
  Top 0.813: JP10.2 JP11.1
N$3
  Top 0.254: R25.2 LED2.A
N$5
  Top 0.813: 27.43,9.02 27.43,15.75 JP10.1
  Top 1.016: SW2.2 27.43,9.02
N$6
  Top 0.254: R11.2 LED4.A
N$8
  Top 0.254: IC5.8 35.29,16.8 R32.1 35.16,16.59 Q4.2
N$9
  Top 0.254: IC5.7 34.79,18.28 34.29,17.78 32.51,17.78 32.03,17.3 R31.1 31.86,16.59 Q5.2
N$10
  Top 0.254: C30.2 69.9,21.31 XTL2.3 68.46,21.73 68.33,21.59 68.33,19.18 68.81,18.7 68.81,18.32 | 68.81,18.32 69.09,18.03 69.09,16.25 IC1.7 | R5.2 68.81,18.32
N$11  (via drill 0.5)
  Top 0.305: IC6.2 v68.07,80.26
  Bottom 0.305: SJ18.1 49.28,18.03 46.74,20.57 30.48,20.57 27.94,23.11 27.94,27.94 30.73,30.73 30.73,42.42 38.35,50.16 75.69,50.16 77.22,51.56 77.22,57.4 75.95,58.67 68.33,58.67 63.75,63.25 63.75,72.14 68.07,76.45 v68.07,80.26
N$12
  Top 0.254: C15.2 19.51,37.11 XTL1.1 20.82,36.69 21.08,36.96 21.08,39.24 20.6,39.72 R1.1 20.6,41.18 21.11,41.68 IC2.1
N$13
  Bottom 0.254: S2.2 7.26,28.96 8.89,28.96 9.47,29.53 RN3.4 8.13,39.53 8.13,41.4 7.62,41.91 4.06,41.91 3.3,41.15 3.3,39.12 4.23,38.19 RN2.8
N$14
  Top 0.254: RN1.6 6.84,45.36 6.6,45.59 6.02,45.59 LED3.4
N$15
  Top 0.254: IC9.10 24.62,85.33 24.89,85.6 24.89,88.14 25.15,88.39 R41.1
N$16
  Top 0.254: RN1.7 6.88,44.56 6.48,44.96 LED3.5
N$17
  Top 0.254: LED3.6 6.08,44.21 6.6,43.69 7.13,43.69 RN1.8
N$18
  Top 0.254: IC9.4 19.55,83.83 19.3,84.07 19.3,85.34 19.14,85.51 L2.1
N$19
  Top 0.254: IC9.5 16.95,83.33 L2.2
N$20
  Top 0.254: IC4.7 49.06,11.95 R24.1
N$21
  Top 0.254: R40.1 20.57,85.68 IC9.1
N$22
  Top 0.254: IC7.4 55.62,83.83 55.37,84.07 55.37,85.34 55.21,85.51 L3.1
N$23
  Top 0.254: C19.1 R41.2
N$24
  Top 0.254: C31.2 66.76,20.35 XTL2.1 67.85,19.13 R5.1 67.85,16.5 IC1.8
N$25
  Top 0.254: C20.2 27.15,83.72 27.05,83.82 26.29,83.82 26.19,83.92 R42.1
N$26
  Top 0.254: C19.2 R44.1 24.92,84.58 24.89,84.58 | R43.1 C20.1 26.19,83.28 24.89,84.58 | IC9.9 24.65,84.83 24.89,84.58
N$27  (via drill 0.5)
  Top 0.254: IC4.4 43.06,11.95 42.93,11.81 42.93,11.18 41.66,9.91 v37.08,9.91 | LED2.C v23.62,3.05
  Route2 0.254: v23.62,3.05 26.16,5.59 32.77,5.59 v37.08,9.91
N$28
  Top 0.254: IC7.5 53.01,83.33 L3.2
N$29
  Top 0.254: R34.1 56.64,85.68 IC7.1
N$30
  Top 0.254: C25.1 R35.2
N$31
  Top 0.254: IC7.10 60.69,85.33 60.96,85.6 60.96,88.14 61.21,88.39 R35.1
N$32
  Top 0.254: C26.2 63.22,83.72 63.12,83.82 62.36,83.82 62.26,83.92 R36.1
N$33
  Top 0.254: C25.2 R38.1 | R37.1 C26.1 62.23,83.09 62.23,83.31 60.96,84.58 | IC7.9 60.71,84.83 60.96,84.58 | 62.25,86.11 R38.1 | R38.1 60.99,84.58 60.96,84.58
N$34
  Top 0.254: IC2.27 19.82,45.2 19.05,45.97 C34.1
N$35
  Top 0.254: IC4.3 R23.1
N$36
  Top 0.254: IC4.6 49.83,11.45 R20.2
N$37
  Top 0.254: R16.2 C10.1
N$38
  Top 0.305: C12.2 9.3,54.96 Z1.1 | 9.26,48.14 Z2.1
  Top 0.406: Z1.1 8.64,55.63 6.58,55.63 S1.PIN1 | Z2.1 8.64,47.75 6.83,47.75 S1.PIN2 | 9.26,48.14 Z3.A 13.83,48.14 L4.2
  Top 0.61: S1.PIN2 3.99,48.19 S1.TAB2 2.54,48.39 S1.FIX2 S1.FIX1 2.54,55.24 S1.TAB1 3.99,55.44 S1.PIN1
N$39  (via drill 0.5)
  Top 0.254: IC3.11 48.88,38.85 50.67,40.64 51.71,40.64 C3.2 52.32,40.41 | IC3.16 46.38,38.45 45.97,38.86 v45.47,38.86 | IC3.9 50.14,38.35 51.56,38.35 v52.32,39.12
  Top 0.406: v52.32,39.12 52.32,40.41 | v53.59,24.9 53.59,23.62 53.09,23.11 Z4.C
  Bottom 0.254: v45.47,38.86 49.78,38.86 50.29,38.35 51.56,38.35 v52.32,39.12
  Bottom 0.406: v52.32,39.12 53.59,37.85 v53.59,24.9
N$40
  Top 0.254: IC3.13 47.88,39.76 48.13,40.01 C6.2
N$41
  Top 0.254: IC3.12 48.38,38.98 49.4,40.01 C8.2
N$42  (via drill 0.5)
  Top 0.254: IC3.15 46.88,39.35 v46.23,40.01 | 38.41,40.01 L1.1 | C6.1 46.99,42.42 v46.86,42.55
  Top 0.61: v46.23,40.01 38.41,40.01
  Route2 0.254: v46.86,42.55 46.23,41.91 v46.23,40.01
N$43  (via drill 0.5)
  Top 0.254: IC3.2 46.88,33.04 v46.23,32.38 | 38.41,32.38 L1.2 | C8.1 v49.4,44.07
  Top 0.61: v46.23,32.38 38.41,32.38
  Route2 0.254: v49.4,44.07 49.4,37.47 46.86,34.92 46.86,33.02 v46.23,32.38
N$44
  Top 0.254: IC3.6 48.88,33.16 49.28,32.77
  Top 0.305: C24.1 49.4,30.35 50.01,30.96 R16.1 50.67,31.37 49.28,32.77
N$45
  Top 0.254: IC3.7 49.38,33.67 50.67,32.38
  Top 0.305: R19.1 47.43,26.9 R18.2 | R18.2 50.11,26.9 C10.2 51.34,27.46 51.82,27.94 51.82,31.75 51.18,32.38 50.67,32.38 | R17.1 48.77,28.73 | 48.77,28.73 C24.2 | R18.2 48.77,28.73
N$46
  Bottom 0.254: RN2.6 6.5,32.4 4.83,30.73 4.83,28.45 5.45,27.82 S2.3 9.03,27.82 10.27,29.06 RN3.3
N$47
  Top 0.254: R15.2 50.52,33.66 IC3.8
N$48
  Bottom 0.254: RN2.7 5.7,32.87 4.06,31.24 4.06,26.16 4.6,25.62 S2.5 6.94,25.51 10.78,25.51 11.43,26.16 11.43,28.7 11.07,29.06 RN3.2
N$49
  Top 0.254: C28.2 R19.2
N$50
  Bottom 0.254: S2.CD1 15.75,21.75 JP8.1
N$51  (via drill 0.5)
  Top 0.305: IC8.2 v32,80.26
  Bottom 0.305: v32,80.26 32,70.87 32,60.96 33.27,59.69 43.18,59.69 45.72,59.69 47.5,57.91 75.44,57.91 76.45,56.9 76.45,52.07 75.31,50.93 38.23,50.93 29.97,42.67 29.97,31.24 27.18,28.45 27.18,22.86 30.23,19.81 46.48,19.81 50.8,15.49 SJ19.1
N$52
  Top 0.254: C14.2 22.65,38.07 XTL1.3 22.23,39.46 R1.2 21.61,40.18 IC2.2
N$53
  Top 0.203: 58.42,27.94 59.79,27.94 Q6.1 | IC10.5 57.4,34.04
  Top 0.254: R45.2 57.04,30.31 Q7.1 57.84,27.94 58.42,27.94 58.42,26.42 57.66,25.65 56.13,25.65 54.86,26.92 54.86,31.75 57.15,34.04 57.4,34.04 | Q6.1 60.59,30.31 R46.2 | 60.45,30.51 R46.2 | SJ14.2 62.23,32.29 R46.2
N$54
  Bottom 0.203: 51.38,70.87 49.28,70.87 48.63,71.52
  Bottom 0.254: IC11.5 IC11.4 52.83,76.71 52.58,76.71 52.32,76.45 52.32,73.41 R47.2 52.18,73.24 Q9.1 51.38,70.87 | 48.63,71.52 Q8.1 48.63,73.24 R48.2 48.8,76.23 SJ15.2
N$55  (via drill 0.5)
  Route15 0.254: v35.05,67.31 50.29,67.31 v51.31,66.29
  Bottom 0.203: Q1.2 50.18,63.58 R9.1
  Bottom 0.254: SJ16.2 35.81,66.55 v35.05,67.31 | v51.31,66.29 50.01,65 R9.1
N$56  (via drill 0.5)
  Top 0.254: IC2.28 v18.8,44.7
  Top 0.406: L4.1 13.94,44.45 SJ11.1 13.21,45.24 v13.21,46.48 | S1.GND 6.38,50.52 v6.86,50.04
  Route2 0.254: v18.8,44.7 14.99,44.7 v13.21,46.48
  Route2 0.61: v6.86,50.04 v7.62,49.28 7.62,47.24 8.38,46.48 v13.21,46.48
N$57  (via drill 0.5)
  Route15 0.254: v35.05,64.77 54.61,64.77 v55.37,64.01
  Bottom 0.254: SJ17.2 35.81,64.01 v35.05,64.77 | 53.95,62.23 Q2.2 53.74,63.58 R10.1 53.82,64.01 v55.37,64.01
N$60
  Top 0.254: SJ7.2 C32.1
N$248
  Top 0.254: R26.2 26.13,4.04 25.91,3.81 25.4,3.81 25.15,3.56 25.15,3.08 LED1.A
N$251  (via drill 0.5)
  Top 0.254: 43.83,11.45 IC4.5 43.7,11.45 43.43,11.18 43.43,10.92 40.89,8.38 v37.59,8.38 | LED1.C v27.43,3.05
  Route2 0.254: v27.43,3.05 32.26,3.05 v37.59,8.38
N$9999
  Top 0.203: IC10.1 59.32,30.48
  Top 0.254: Q6.2 59.32,28.77 59.32,30.48 R46.1
N$10001
  Top 0.203: IC10.6 57.77,33.13
  Top 0.254: Q7.2 55.74,30.31 R45.1 55.91,31.27 57.77,33.13
N$10002
  Bottom 0.254: Q9.2 53.48,73.24 R47.1 53.31,75.62 IC11.6
N$10003
  Bottom 0.254: Q8.2 49.9,71.7 49.9,73.41 R48.1 49.76,74.04 IC11.1
PVIN  (via drill 0.5)
  Top 0.254: IC3.14 47.38,40.25 | 44.32,45.71 C9.2 | IC3.10 49.38,38.72 50.04,39.37 v50.67,39.37 | v45.59,33.66 46.23,33.66 46.38,33.81 IC3.1
  Top 0.406: 47.38,40.25 46.48,41.15 | 44.45,45.6 C9.2
  Top 0.61: 46.48,41.15 44.96,41.15 44.45,41.66 44.45,45.6
  Top 0.813: C9.2 v46.48,46.23
  Route2 0.813: S3.PWR 15.24,13.19 15.24,8.13 12.45,5.33 JP9.2 13.97,1.27 53.34,1.27 JP3.8 53.34,8.89 51.31,8.89 50.29,9.91 50.29,17.27 44.7,22.86 44.7,32.77 v45.59,33.66
  Route15 0.254: v50.67,39.37 50.04,39.37 49.4,38.73 49.4,37.47 v45.59,33.66
  Bottom 0.813: v46.48,46.23 46.48,44.96 50.67,40.77 v50.67,39.37
PVOUT
  Top 0.254: IC3.3 47.38,31.89 | IC4.10 46.89,13.7 | Z4.A 47,22.61 46.99,22.6
  Top 0.305: R17.2 48.13,30.35 47.53,30.96 C28.1 | 47.38,31.89 46.86,31.37 C28.1 | C28.1 45.44,30.96 44.78,30.3 C29.POS
  Top 0.61: 46.23,16 46.23,15.75 46.89,15.09 46.89,13.7 | Z4.A 45.47,23.11 44.78,23.8 C29.POS | C5.2 46.2,16.03 46.23,16 | 46.23,16 46.23,17.02 46.99,17.78 46.99,22.6
QST
  Top 0.254: R30.2 32,18.8 32.51,18.29 34.04,18.29 34.29,18.55 IC5.6
RD+
  Top 0.254: 9.65,51.05 10.92,49.78 13.46,49.78 14.73,48.51 16.26,48.51 16.76,48.01 16.76,44.2 17.27,43.69 19.3,43.69 19.82,44.2 IC2.29
  Top 0.305: R4.2 9.65,51.05
RD-  (via drill 0.5)
  Top 0.254: 9.65,52.32 11.18,50.8 13.72,50.8 15.24,49.28 16.51,49.28 17.78,48.01 v17.78,45.72 | v17.78,42.67 19.05,42.67 20.08,43.7 IC2.30
  Top 0.305: R3.2 9.65,52.32
  Bottom 0.254: v17.78,45.72 v17.78,42.67
RESET  (via drill 0.5)
  Top 0.254: IC1.29 72.74,8.64 74.68,8.64 | 74.68,8.64 v78.49,8.64 83.8,8.64 SW1.2 | R6.1 74.68,8.64 | C32.2 30.73,46.51 v30.73,47.75
  Route2 0.254: v78.49,8.64 78.49,15.24 77.47,16.26 77.47,23.11 75.07,25.51 JP2.5
  Route15 0.254: JP3.3 46.48,7.11 58.42,7.11 59.94,8.64 v78.49,8.64
  Bottom 0.254: v30.73,47.75 28.96,45.97 28.96,39.12 | 29.97,19.05 46.23,19.05 53.85,11.43 53.85,8.13 52.83,7.11 46.48,7.11 JP3.3
  Bottom 0.305: 29.97,19.05 26.42,22.61 26.42,28.96 28.96,31.5 28.96,39.12
RESET2
  Top 0.254: R2.1 16.51,50.55 17.78,49.28 21.08,49.28 | 21.08,49.28 22.61,49.28 JP1.5 | IC2.24 21.11,49.25 21.08,49.28
RXLED  (via drill 0.5)
  Top 0.254: IC2.10 25.18,43.18 v27.43,43.18 | v2.79,43.69 3.31,44.21 LED3.3
  Route2 0.254: v27.43,43.18 27.43,40.89 24.13,37.59 17.53,37.59 15.49,39.62 15.49,41.15 14.73,41.91 4.57,41.91 v2.79,43.69
SCK2
  Top 0.254: JP1.3 20.32,52.07 20.32,54.36 21.59,55.63 25.65,55.63 26.92,54.36 26.92,49.78 25.91,48.77 25.91,45.97 25.63,45.7 IC2.15
SCL  (via drill 0.5)
  Top 0.254: Q5.3 v33.78,12.45 | v56.64,24.64 57.44,24.64 Q6.3
  Route15 0.254: v49.53,59.18 54.86,53.85 54.86,42.42 v58.17,39.12 59.69,37.59 59.69,27.69 59.18,27.18 | 59.18,27.18 v56.64,24.64 | v33.78,12.45 41.4,20.07 52.32,20.07 54.86,22.61 54.86,26.92 56.13,28.19 58.17,28.19 59.18,27.18
  Bottom 0.254: SJ13.1 v58.17,39.12 R13.1 | 49.28,69.85 Q8.3 49.02,69.6 46.99,67.56 46.99,61.47 48.01,60.45 49.49,60.45 Q1.3 v49.53,59.18
SDA  (via drill 0.5)
  Top 0.254: Q4.3 v35.81,12.19 | v57.4,26.67 56.86,26.67 Q7.3
  Route15 0.254: v53.09,59.18 55.63,56.64 55.63,46.23 v60.2,41.66 60.2,26.67 57.15,23.62 55.63,23.62 | v57.4,26.67 56.13,26.67 55.63,26.16 55.63,23.62 | 55.63,23.62 55.63,22.35 52.58,19.3 42.93,19.3 v35.81,12.19
  Bottom 0.203: 48.26,61.21 50.8,61.21
  Bottom 0.254: SJ12.1 v60.2,41.66 R14.1 | 48.26,61.21 47.75,61.72 47.75,67.31 48.77,68.33 52.32,68.33 52.83,68.83 Q9.3 | 50.8,61.21 51.56,60.45 53.05,60.45 Q2.3 v53.09,59.18
SYS_SCL  (via drill 0.5)
  Route15 0.254: v70.36,32.51 72.14,32.51 74.3,34.67 79.12,34.67 80.39,33.4 80.39,23.5 81.15,22.86 H1.43
  Bottom 0.254: v70.36,32.51 69.34,32.51 68.83,33.02 68.83,37.85 67.56,39.12 SJ13.2
SYS_SDA  (via drill 0.5)
  Route15 0.254: v70.36,34.29 72.77,34.29 74.04,35.56 80.14,35.56 81.41,34.29 81.41,25.91 81.92,25.4 H1.41
  Bottom 0.254: v70.36,34.29 70.36,40.13 68.83,41.66 SJ12.2
TXLED  (via drill 0.5)
  Top 0.254: IC2.11 26.43,43.7 27.18,44.45 v27.94,44.45 | v3.05,45.47 3.56,44.96 LED3.2
  Route2 0.254: v27.94,44.45 27.18,44.45 26.16,43.43 26.16,40.64 23.88,38.35 17.78,38.35 16,40.13 16,41.66 15.24,42.42 6.1,42.42 v3.05,45.47
USB_I  (via drill 0.5)
  Top 0.254: 38.87,12.95 38.87,12.96 39.12,13.21 42.67,13.21 42.93,12.95 IC4.2 | 38.87,12.95 38.86,12.95 v38.86,11.94 | 38.87,12.95 R22.1
  Bottom 0.305: SJ10.1 55.63,12.95 54.86,12.19 54.86,8.13 55.88,7.11 57.91,7.11 58.93,6.1 58.93,4.06 57.91,3.05 38.61,3.05 37.59,4.06 37.59,6.1 38.86,7.37 v38.86,11.94
USBRXD
  Top 0.254: IC2.9 26.16,42.7 R8.2
USBTXD
  Top 0.254: IC2.8 25.19,42.15 R7.2
USBVCC  (via drill 0.5)
  Top 0.254: IC4.1 44.04,13.62 43.94,13.72 | RN1.2 RN1.1 8.87,43.69 v10.16,43.69 | JP1.2 17.3,53.34 R2.2 | C33.1 R20.1 v52.07,11.68 | IC2.31 IC2.32 20.09,42.7 v19.05,41.66 | IC2.4 22.61,41.4 v23.37,40.64
  Top 0.305: C12.1 12.36,52.44 Z3.C 16.4,52.44 R2.2
  Top 0.406: S1.VBUS 6.38,53.12 v6.86,53.59
  Top 0.61: v6.86,53.59 v7.62,54.36
  Top 0.813: C4.2 v40.39,14.22 v41.66,14.22 43.43,14.22 43.94,13.72
  Bottom 0.254: v52.07,11.68 49.53,14.22 v41.66,14.22 | 16.26,41.66 v19.05,41.66 20.07,40.64 v23.37,40.64 | v10.16,43.69 16.26,43.69
  Bottom 0.61: 16.51,52.58 R2.2 14.7,54.36 v7.62,54.36 v6.86,53.59
  Bottom 0.813: JP1.2 17.27,53.34 16.51,52.58 16.26,52.32 16.26,43.69 16.26,41.66 16.26,40.13 19.56,36.83 21.84,36.83 24.13,34.54 24.13,20.07 29.97,14.22 v40.39,14.22 v41.66,14.22
VBATT  (via drill 0.5)
  Top 0.254: IC6.4 69.02,85.79 69.6,86.36 69.6,86.7 R33.1 | IC8.4 32.95,85.79 33.53,86.36 33.53,86.7 R39.1
  Top 0.813: v73.91,87.38 v72.39,87.38 R33.1 | R39.1 v36.32,87.38 v37.85,87.38 | v29.72,25.15 v29.72,26.67 22.86,33.53 JP11.2
  Bottom 0.813: 69.85,23.37 71.88,25.4 71.88,43.56 80.77,52.7 80.77,84.33 77.72,87.38 v73.91,87.38 61.47,87.38 60.2,88.65 56.13,88.65 54.86,87.38 v36.32,87.38 | 69.85,23.37 31.5,23.37 v29.72,25.15 v29.72,26.67 | 69.85,23.37 SJ2.1 SJ1.1
VBATT45
  Bottom 0.508: 82.3,19.05 86.98,19.05 H2.45
  Bottom 0.813: SJ1.2 82.3,19.05
VBATT46
  Bottom 0.508: 82.3,21.59 89.52,21.59 H2.46
  Bottom 0.813: SJ2.2 82.3,21.59
VCC_SYS_27
  Top 0.508: 86.61,44.45 82.3,44.45
  Top 0.813: H2.27 86.98,44.45 86.61,44.45 | 82.3,44.45 81.03,44.45 77.22,40.64 SJ5.2
VCC_SYS_28  (1 unrouted)

## Text on the board
tPlace: 3.3V | 5V | H1 | H2 | www.freetronics.com/lspsm | www.LibreSat.org | v1.1 | ICSP | 13 | 12 | 11 | 10 | 9 | 8 | 7 | 6 | 5 | 4 | 3 | 2 | 1 | 0 | SCL | SDA | GND | UBOOT | ~ | ~ | ~ | DIGITAL | ~ | ~ | ~ | AREF | CUBESAT BUS | RESET-EN | 5V | H2-25/26 | UGND | 5V | H1-51 | 3V3 | H2-27/28 | 3V3 | H1-52 | Deployment Switch | TMP102 | ICSP | Deployment | I2C: 0x48 | Remove-Before-Flight Switch | RBF | freetronics | 2.7-40Vdc | CD | 2.1mm | (DC IN) | ANALOG | DC IN | IOREF | RST | 3V3 | 5V | GND | GND | VIN | 0 | 1 | 2 | 3 | 4 | 5 | 6 | 7 | OFF | ON | RESET | VIN | CHRG | 3V3 | 5V | LibreSat Power Supply Module
bPlace: LibreSat Power Supply Module | by Jonathan Oxer | Select "Arduino Uno" / in the IDE | tron.cc/lspsm | TMP102 | H1 | H2 | SKU: LSPSM | 1 | 2 | 1 | 2 | v1.1 | I2C: 0x49 | A4/5 ISOLATION | SCL | A5 | SDA | A4 | Copyright 2014 Freetronics / www.freetronics.com/lspsm | freetronics | www.freetronics.com | Released under the TAPR / Open Hardware License / www.tapr.org/OHL | I2C PULLUPS | 5V | CUBESAT I2C | 3V3 | SDA | H1-41 | GND | SCL | H1-43 | GND | CUBESAT BUS / H1-41: SDA / H1-43: SCL / H2-25: 5V / H2-26: 5V / H2-27: 3V3 / H2-28: 3V3 / H2-29: GND / H2-30: GND / H2-32: GND / H2-45: VBATT45 / H2-46: VBATT46 | SD CARD / D4: nCS / D11: MOSI / D12: MISO / D13: SCK | SDA | RAW VBATT | SCL | H2-46 | CD | A0-3 ISOLATION | H2-45 | 5V mA | A7 | I2C ADDRESSES / 0x36: MAX17043G+U / 0x48: TMP102 (TOP) / 0x49: TMP102 (BOT) | 3V3 mA | A6 | USB mA | A1 | DC mA | A0 | 51 | 52 | 51 | 52
tNames: LED3 | SW1